# EAGLE schematic Schematic (EAGLE 7.6.0)
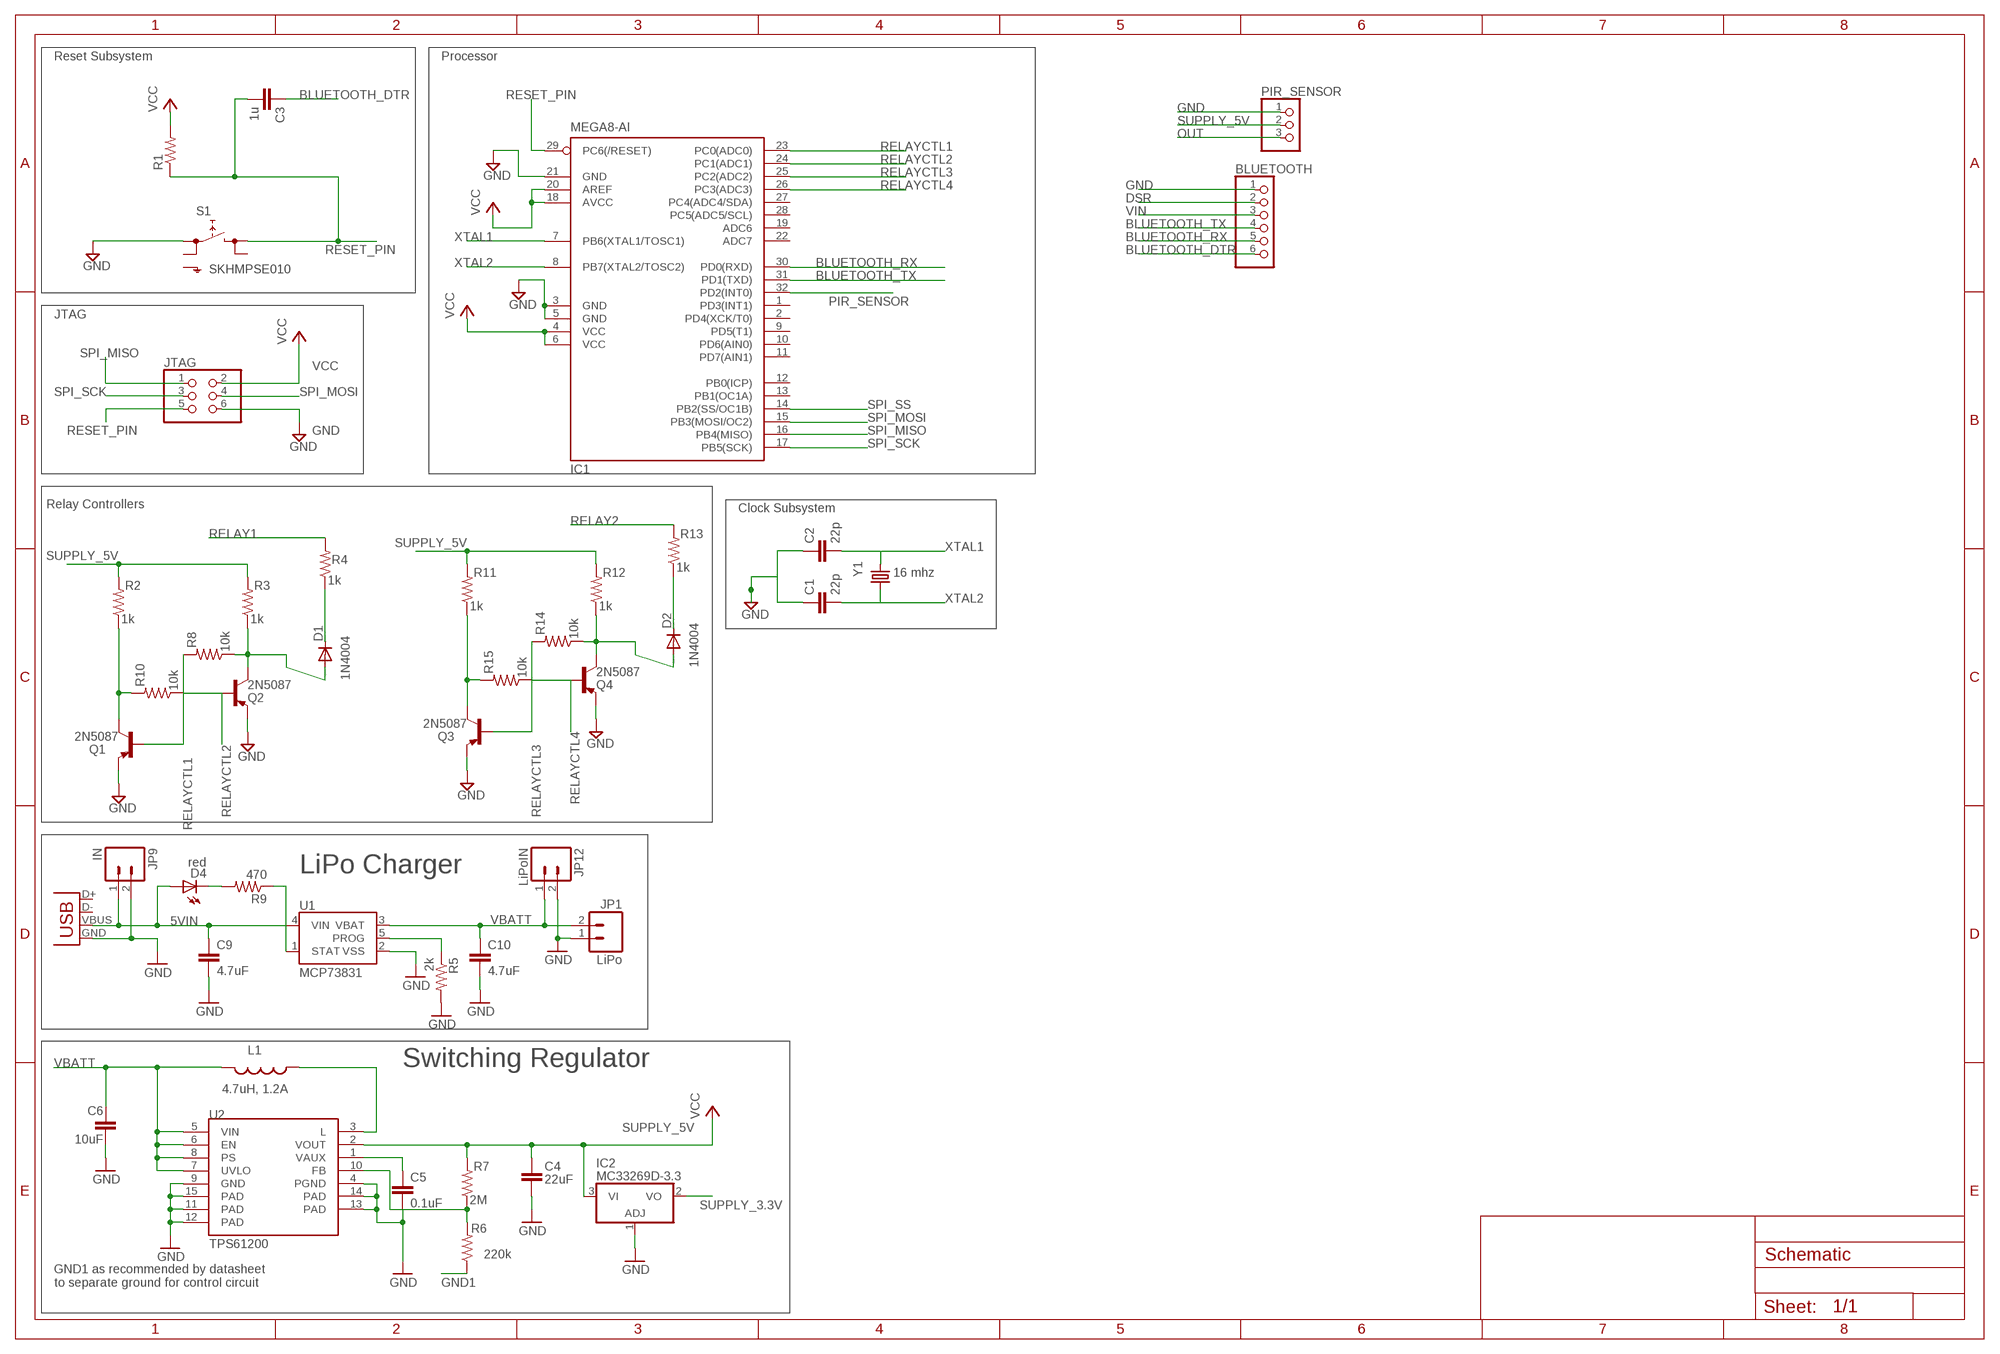
[diagram p0: schematic, sheet 1]

## Parts
BLUETOOTH  PINHD-1X6  [1X06]
C1  22p  C-EUC0603  [C0603]
C2  22p  C-EUC0603  [C0603]
C3  1u  C-EUC0603  [C0603]
C4  22uF  CAP0805  [0805]
C5  0.1uF  CAP0402-CAP  [0402-CAP]
C6  10uF  CAP1206  [1206]
C9  4.7uF  CAP0402-CAP  [0402-CAP]
C10  4.7uF  CAP0402-CAP  [0402-CAP]
D1  1N4004  [DO41-10]
D2  1N4004  [DO41-10]
D4  red  LED0603  [LED-0603]
IC1  MEGA8-AI  [TQFP32-08]
IC2  MC33269D-3.3  [DPACK]
JP1  LiPo  M02-JST-2MM-SMT  [JST-2-SMD]
JP9  IN  M02PTH  [1X02]
JP12  LiPoIN  M02PTH  [1X02]
JTAG  PINHD-2X3  [2X03]
L1  4.7uH, 1.2A  INDUCTOR.  [CDRH2D09]
PIR_SENSOR  PINHD-1X3  [1X03]
Q1  2N5087  [TO92]
Q2  2N5087  [TO92]
Q3  2N5087  [TO92]
Q4  2N5087  [TO92]
R1  R-US_R0603  [R0603]
R2  1k  RESISTOR0402-RES  [0402-RES]
R3  1k  RESISTOR0402-RES  [0402-RES]
R4  1k  RESISTOR0402-RES  [0402-RES]
R5  2k  RESISTOR0402-RES  [0402-RES]
R6  220k  RESISTOR0402-RES  [0402-RES]
R7  2M  RESISTOR0402-RES  [0402-RES]
R8  10k  RESISTOR0402-RES  [0402-RES]
R9  470  RESISTOR0402-RES  [0402-RES]
R10  10k  RESISTOR0402-RES  [0402-RES]
R11  1k  RESISTOR0402-RES  [0402-RES]
R12  1k  RESISTOR0402-RES  [0402-RES]
R13  1k  RESISTOR0402-RES  [0402-RES]
R14  10k  RESISTOR0402-RES  [0402-RES]
R15  10k  RESISTOR0402-RES  [0402-RES]
S1  SKHMPSE010  [SKHMPXE010]
U1  MCP73831  [SOT23-5]
U2  TPS61200  [QFN-10_PAD]
X1  USB-MICROB  [USB-MICROB]
Y1  16 mhz  CRYSTALHC49UV  [HC49U-V]

## Nets
5VIN: C9.1 D4.A JP9.1 U1.4(VIN) X1.VBUS
BLUETOOTH_DTR: BLUETOOTH.6 C3.1
BLUETOOTH_RX: BLUETOOTH.5 IC1.30(PD0(RXD))
BLUETOOTH_TX: BLUETOOTH.4 IC1.31(PD1(TXD))
DSR: BLUETOOTH.2
FB: R6.2 R7.1 U2.10(FB)
GND: BLUETOOTH.1 C1.1 C2.1 C4.2 C5.2 C6.2 C9.2 C10.2 IC1.3(GND) IC1.5(GND) IC1.21(GND) IC2.1(ADJ) JP1.1 JP9.2 JP12.2 JTAG.6 PIR_SENSOR.1 Q1.3(E) Q2.3(E) Q3.3(E) Q4.3(E) R5.2 S1.1(1.1) U1.2(VSS) U2.4(PGND) U2.9(GND) U2.11(PAD) U2.12(PAD) U2.13(PAD) U2.14(PAD) U2.15(PAD) X1.GND
GND1: R6.1
N$2: L1.P$1 U2.3(L)
N$3: C5.1 U2.1(VAUX)
N$4: Q1.1(C) R2.1 R10.2
N$5: Q3.1(C) R11.1 R15.2
N$6: D2.A Q4.1(C) R12.1 R14.1
N$7: D1.A Q2.1(C) R3.1 R8.1
N$8: D4.C R9.2
N$9: D2.C R13.1
N$11: R5.1 U1.5(PROG)
N$12: D1.C R4.1
N$14: R9.1 U1.1(STAT)
OUT: PIR_SENSOR.3
PIR_SENSOR: IC1.32(PD2(INT0))
RELAY1: R4.2
RELAY2: R13.2
RELAYCTL1: IC1.23(PC0(ADC0)) Q1.2(B) R8.2
RELAYCTL2: IC1.24(PC1(ADC1)) Q2.2(B) R10.1
RELAYCTL3: IC1.25(PC2(ADC2)) Q3.2(B) R14.2
RELAYCTL4: IC1.26(PC3(ADC3)) Q4.2(B) R15.1
RESET_PIN: C3.2 IC1.29(PC6(/RESET)) JTAG.5 R1.1 S1.3(2.1)
SPI_MISO: IC1.16(PB4(MISO)) JTAG.1
SPI_MOSI: IC1.15(PB3(MOSI/OC2)) JTAG.4
SPI_SCK: IC1.17(PB5(SCK)) JTAG.3
SPI_SS: IC1.14(PB2(SS/OC1B))
SUPPLY_3.3V: IC2.2(VO)
SUPPLY_5V: C4.1 IC2.3(VI) PIR_SENSOR.2 R2.2 R3.2 R7.2 R11.2 R12.2 U2.2(VOUT) ; supply symbol labelled VCC
VBATT: C6.1 C10.1 JP1.2 JP12.1 L1.P$2 U1.3(VBAT) U2.5(VIN) U2.6(EN) U2.7(UVLO) U2.8(PS)
VCC: IC1.4(VCC) IC1.6(VCC) IC1.18(AVCC) IC1.20(AREF) JTAG.2 R1.2
VIN: BLUETOOTH.3
XTAL1: C2.2 IC1.7(PB6(XTAL1/TOSC1)) Y1.2
XTAL2: C1.2 IC1.8(PB7(XTAL2/TOSC2)) Y1.1
Unconnected: IC1.1(PD3(INT1)) IC1.2(PD4(XCK/T0)) IC1.9(PD5(T1)) IC1.10(PD6(AIN0)) IC1.11(PD7(AIN1)) IC1.12(PB0(ICP)) IC1.13(PB1(OC1A)) IC1.19(ADC6) IC1.22(ADC7) IC1.27(PC4(ADC4/SDA)) IC1.28(PC5(ADC5/SCL)) S1.2(1.2) S1.4(2.2) S1.5(SH) X1.D+ X1.D-

## Notes on the sheet
- Reset Subsystem | Processor
- JTAG
- Relay Controllers
- Clock Subsystem
- LiPo Charger
- Switching Regulator
- GND1 as recommended by datasheet 
  to separate ground for control circuit

## Library data of the parts
BLUETOOTH = pinhead:PINHD-1X6: PIN HEADER
C1-C3 = rcl:C-EU: CAPACITOR, European symbol
C4 C6 = CH_passive:CAP: Capacitor Standard 0603 ceramic capacitor, and 0.1" leaded capacitor.
C5 C9 C10 = SparkFun:CAP: Capacitor Standard 0603 ceramic capacitor, and 0.1" leaded capacitor.
D1 D2 = diode:1N4004: DIODE general purpose rectifier, 1 A
D4 = SparkFun:LED: LEDs Standard schematic elements and footprints for 5mm, 3mm, 1206, and 0603 sized LEDs. 5mm - Spark Fun Electronics SKU : COM-00529 (and others)
IC1 = atmel:MEGA8: MICROCONTROLLER 8 Kbytes FLASH, 1 kbytes SRAM, 512 bytes EEPROM, USART, 6-channel 10 bit ADC, 2-channel 8 bit ADC Pin compatible with Atmega48, ATMega88, ATMega168 Source: avr.lbr; MPN: ATMEGA8-16AU; OC_FARNELL: 9171371; OC_NEWARK: 73M8863
IC2 = linear:MC33269?*: Adjustable Output Low Dropout Voltage Regulator 800 mA Source: http://www.onsemi.com/pub/Collateral/MC33269-D.PDF
JP1 JP9 JP12 = SparkFun:M02: Header 2 Standard 2-pin 0.1" header. Use with straight break away headers (SKU : PRT-00116), right angle break away headers (PRT-00553), swiss pins (PRT-00743), machine pins (PRT-00117), and female headers (PRT-00115). Molex polarized connector foot print use with SKU : PRT-08233 with associated crimp pins and housings.
JTAG = pinhead:PINHD-2X3: PIN HEADER
L1 = SparkFun:INDUCTOR: Inductors Basic Inductor/Choke - 0603 and 1206. Footprints are not proven and vary greatly between part numbers.
PIR_SENSOR = pinhead:PINHD-1X3: PIN HEADER
Q1-Q4 = transistor-pnp:2N5087: PNP Transistor
R1 = resistor:R-US_: RESISTOR, American symbol
R2-R15 = SparkFun:RESISTOR: Resistor Basic schematic elements and footprints for 0603, 1206, and PTH resistors.
S1 = switch:SKHMP*E010: 6.2 X 6.5mm TACT Switch (SMD) Source: http://www3.alps.co.jp/WebObjects/catalog.woa/PDF/E/Switch/Tact/SKHM/SKHM.PDF
U1 = SparkFun:MCP73831: Microchip's MCP73831 Miniature single cell, fully integrated Li-Ion, Li-polymer charge management controller http://ww1.microchip.com/downloads/en/DeviceDoc/21984a.pdf
U2 = SparkFun:TPS61200: DC to DC Booster
X1 = SparkFun:USB: USB Connectors USB-B-PTH is fully proven SKU : PRT-00139 USB-miniB is fully proven SKU : PRT-00587 USB-A-PCB is untested. USB-A-H is throughly reviewed, but untested. Spark Fun Electronics SKU : PRT-00437 USB-B-SMT is throughly reviewed, but untested. Needs silkscreen touching up. USB-A-S has not been used/tested USB-MB-H has not been used/tested
Y1 = SparkFun-FreqCtrl:CRYSTAL: Various standard crystals. Proven footprints.